# Altium schematic sheet Control_Acceso.SchDoc
size A4; SheetNumber: 2; SheetTotal: 2
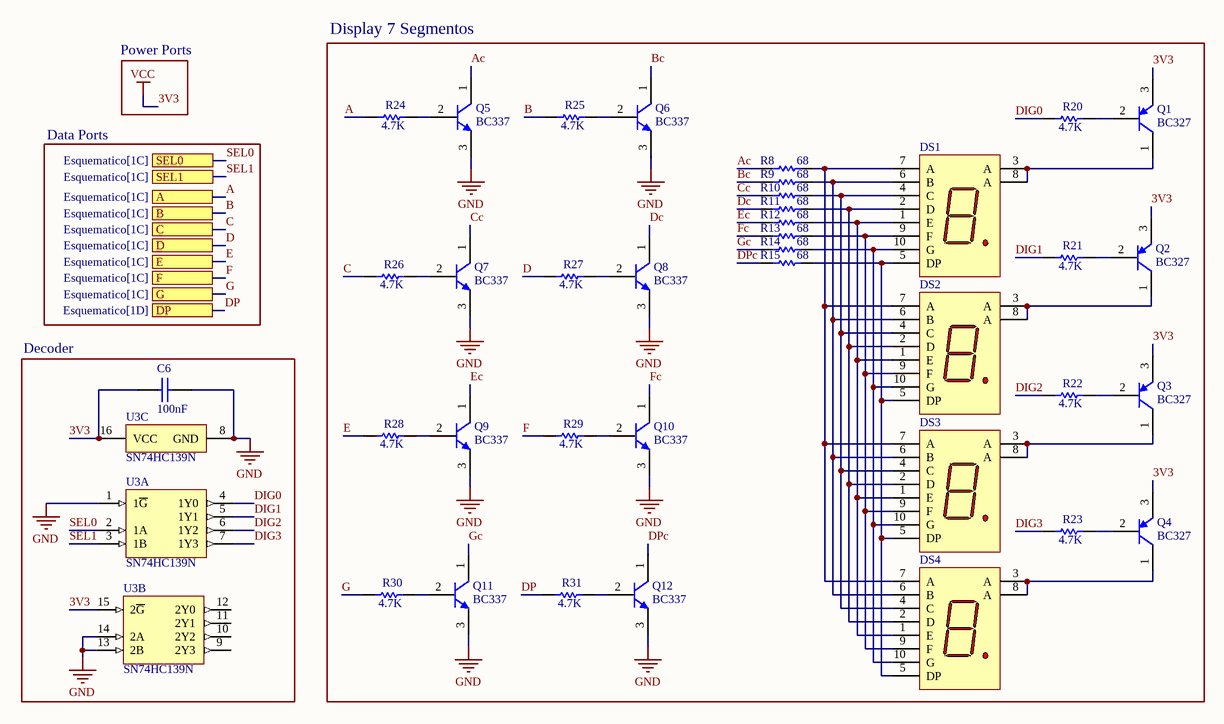
[diagram p0: Control_Acceso.SchDoc]

## Parts
C6  100nF  [CAP200]
DS1  (no value)  [WL-T7DS_L17.5W12.4H7]
DS2  (no value)  [WL-T7DS_L17.5W12.4H7]
DS3  (no value)  [WL-T7DS_L17.5W12.4H7]
DS4  (no value)  [WL-T7DS_L17.5W12.4H7]
Q1  BC327  [ONSC-TO-92-3-29-11_AM_BL]
Q2  BC327  [ONSC-TO-92-3-29-11_AM_BL]
Q3  BC327  [ONSC-TO-92-3-29-11_AM_BL]
Q4  BC327  [ONSC-TO-92-3-29-11_AM_BL]
Q5  BC337  [ONSC-TO-92-3-29-11_AM_BL]
Q6  BC337  [ONSC-TO-92-3-29-11_AM_BL]
Q7  BC337  [ONSC-TO-92-3-29-11_AM_BL]
Q8  BC337  [ONSC-TO-92-3-29-11_AM_BL]
Q9  BC337  [ONSC-TO-92-3-29-11_AM_BL]
Q10  BC337  [ONSC-TO-92-3-29-11_AM_BL]
Q11  BC337  [ONSC-TO-92-3-29-11_AM_BL]
Q12  BC337  [ONSC-TO-92-3-29-11_AM_BL]
R8  68  [RES400]
R9  68  [RES400]
R10  68  [RES400]
R11  68  [RES400]
R12  68  [RES400]
R13  68  [RES400]
R14  68  [RES400]
R15  68  [RES400]
R20  4.7K  [RES400]
R21  4.7K  [RES400]
R22  4.7K  [RES400]
R23  4.7K  [RES400]
R24  4.7K  [RES400]
R25  4.7K  [RES400]
R26  4.7K  [RES400]
R27  4.7K  [RES400]
R28  4.7K  [RES400]
R29  4.7K  [RES400]
R30  4.7K  [RES400]
R31  4.7K  [RES400]
U3  SN74HC139N  [N0016A]  (parts A,B,C of 3)

## Blocks framed on the sheet
Display 7 Segmentos: DS1-DS4 Q1-Q12 R8-R15 R20-R31
Decoder: C6 U3

## Ports
A (see Esquematico[1C]), B (see Esquematico[1C]), C (see Esquematico[1C]), D (see Esquematico[1C]), DP (see Esquematico[1D]), E (see Esquematico[1C]), F (see Esquematico[1C]), G (see Esquematico[1C]), SEL0 (see Esquematico[1C]), SEL1 (see Esquematico[1C])

## Nets
3V3: C6.1 Q1.3(E) Q2.3(E) Q3.3(E) Q4.3(E) U3.15(2~{G}) U3.16(VCC)  [also labelled VCC]
GND: C6.2 Q5.3(E) Q6.3(E) Q7.3(E) Q8.3(E) Q9.3(E) Q10.3(E) Q11.3(E) Q12.3(E) U3.1(1~{G}) U3.8(GND) U3.13(2B) U3.14(2A)
A: R24.1 ; port A
Ac: Q5.1(C) R8.1
B: R25.1 ; port B
Bc: Q6.1(C) R9.1
C: R26.1 ; port C
Cc: Q7.1(C) R10.1
D: R27.1 ; port D
Dc: Q8.1(C) R11.1
DIG0: R20.1 U3.4(1Y0)
DIG1: R21.1 U3.5(1Y1)
DIG2: R22.1 U3.6(1Y2)
DIG3: R23.1 U3.7(1Y3)
DP: R31.1 ; port DP
DPc: Q12.1(C) R15.1
E: R28.1 ; port E
Ec: Q9.1(C) R12.1
F: R29.1 ; port F
Fc: Q10.1(C) R13.1
G: R30.1 ; port G
Gc: Q11.1(C) R14.1
SEL0: U3.2(1A) ; port SEL0
SEL1: U3.3(1B) ; port SEL1
NetDS1_1: DS1.1(E) DS2.1(E) DS3.1(E) DS4.1(E) R12.2
NetDS1_2: DS1.2(D) DS2.2(D) DS3.2(D) DS4.2(D) R11.2
NetDS1_3: DS1.3(A) DS1.8(A) Q1.1(C)
NetDS1_4: DS1.4(C) DS2.4(C) DS3.4(C) DS4.4(C) R10.2
NetDS1_5: DS1.5(DP) DS2.5(DP) DS3.5(DP) DS4.5(DP) R15.2
NetDS1_6: DS1.6(B) DS2.6(B) DS3.6(B) DS4.6(B) R9.2
NetDS1_7: DS1.7(A) DS2.7(A) DS3.7(A) DS4.7(A) R8.2
NetDS1_9: DS1.9(F) DS2.9(F) DS3.9(F) DS4.9(F) R13.2
NetDS1_10: DS1.10(G) DS2.10(G) DS3.10(G) DS4.10(G) R14.2
NetDS2_3: DS2.3(A) DS2.8(A) Q2.1(C)
NetDS3_3: DS3.3(A) DS3.8(A) Q3.1(C)
NetDS4_3: DS4.3(A) DS4.8(A) Q4.1(C)
NetQ1_2: Q1.2(B) R20.2
NetQ2_2: Q2.2(B) R21.2
NetQ3_2: Q3.2(B) R22.2
NetQ4_2: Q4.2(B) R23.2
NetQ5_2: Q5.2(B) R24.2
NetQ6_2: Q6.2(B) R25.2
NetQ7_2: Q7.2(B) R26.2
NetQ8_2: Q8.2(B) R27.2
NetQ9_2: Q9.2(B) R28.2
NetQ10_2: Q10.2(B) R29.2
NetQ11_2: Q11.2(B) R30.2
NetQ12_2: Q12.2(B) R31.2

Not connected (* = marked no-connect by the designer): U3 9(2Y3) 10(2Y2) 11(2Y1) 12(2Y0)

## Notes on the sheet
- Power Ports
- Data Ports

## Library data of the parts
C6 = CAP: Multilayer Ceramic Capacitor
DS1-DS4 = CMP-03913-119893999-3: 7-Seg Display, Comm Anode, Super Red Rohs Compliant: Yes; Forward Voltage: 2V; Dominant Wavelength: 635nm; Max Reverse Voltage (DC): 5V; Forward Current: 100mA; Luminous Intensity: 20mcd; Width: 12.4mm; Max Operating Temperature: 85°C; Min Operating Temperature: -40°C; Height: 7mm; RoHS: Compliant; Length: 17.5mm
Q1-Q4 = CMP-1048-01577-1: Amplifier Transistor, PNP Silicon, 3-Pin TO-92, Pb-Free, Ammo Box; Manufacturer: On Semiconductor; PartNumber: BC327-25ZL1G; IC Continuous (A): -0.8; ComponentLink2URL: http://www.onsemi.com/pub_link/Collateral/BC327-D.PDF; ComponentLink1Description: Manufacturer URL; PackageReference: TO-92-3-29-11_AM_BL; Polarity: PNP; ComponentLink1URL: http://www.onsemi.com/; ComponentLink3Description: Package Specification; PackageDescription: 3-Pin Transistor Outline, Body 4.825 x 3.685 mm, Pitch 1.27 mm; PackageVersion: Rev. AM; ComponentLink3URL: http://www.onsemi.com/pub_link/Collateral/MAC97-D.PDF; ComponentLink2Description: Datasheet; RoHS: TRUE; DatasheetVersion: Rev. 6; Mounting Technology: Through Hole; Packing: Ammo Box
Q5-Q12 = CMP-1048-01583-1: Amplifier Transistor, NPN Silicon, 3-Pin TO-92, Pb-Free, Ammo Box; PartNumber: BC337-40ZL1G; Manufacturer: On Semiconductor; IC Continuous (A): 0.8; ComponentLink2URL: http://www.onsemi.com/pub_link/Collateral/BC337-D.PDF; PackageReference: TO-92-3-29-11_AM_BL; ComponentLink1Description: Manufacturer URL; RoHS: TRUE; PackageVersion: Rev. AM; ComponentLink3URL: http://www.onsemi.com/pub_link/Collateral/MAC97-D.PDF; ComponentLink3Description: Package Specification; Packing: Ammo Box; DatasheetVersion: Rev. 8; Polarity: NPN; ComponentLink1URL: http://www.onsemi.com/; ComponentLink2Description: Datasheet; PackageDescription: 3-Pin Transistor Outline, Body 4.825 x 3.685 mm, Pitch 1.27 mm; Mounting Technology: Through Hole
R8-R15 R20-R31 = RES: Through Hole Resistor 1/8W Carbon Film
U3 = CMP-1633-00660-2: Dual 2-Line To 4-Line Decoders/Demultiplexers, N0016A, TUBE; Manufacturer: Texas Instruments; Technology Family: HC; VCC(Min)(V): 2; Voltage(Nom)(V): 3.3,5; F @ Nom Voltage(Max)(Mhz): 28; Output Type: CMOS; Bits(#): 4; VCC(Max)(V): 6; ICC @ Nom Voltage(Max)(mA): 0.08; Function: Decoder/Demultiplexer; Input Type: LVTTL/CMOS; Output Drive (IOL/IOH)(Max)(mA): 5.2/-5.2; Schmitt Trigger: No; Rating: Catalog; Configuration: 2：4; tpd @ Nom Voltage(Max)(ns): 44; Code_JEDEC: MS-001; DatasheetVersion: SCLS108D; Generic Part Number: SN74HC139; Operating Temperature Range(C): -40 to 85; PackageReference: N0016A; Channels(#): 2; Type: Standard